# EasyEDA schematic Sheet_1.json
TITLE: Sheet_1; REV: 1.0; Date: 2025-05-09; Sheet: 1/1; Drawn By: ahmadputracahyo; Company: Your Company
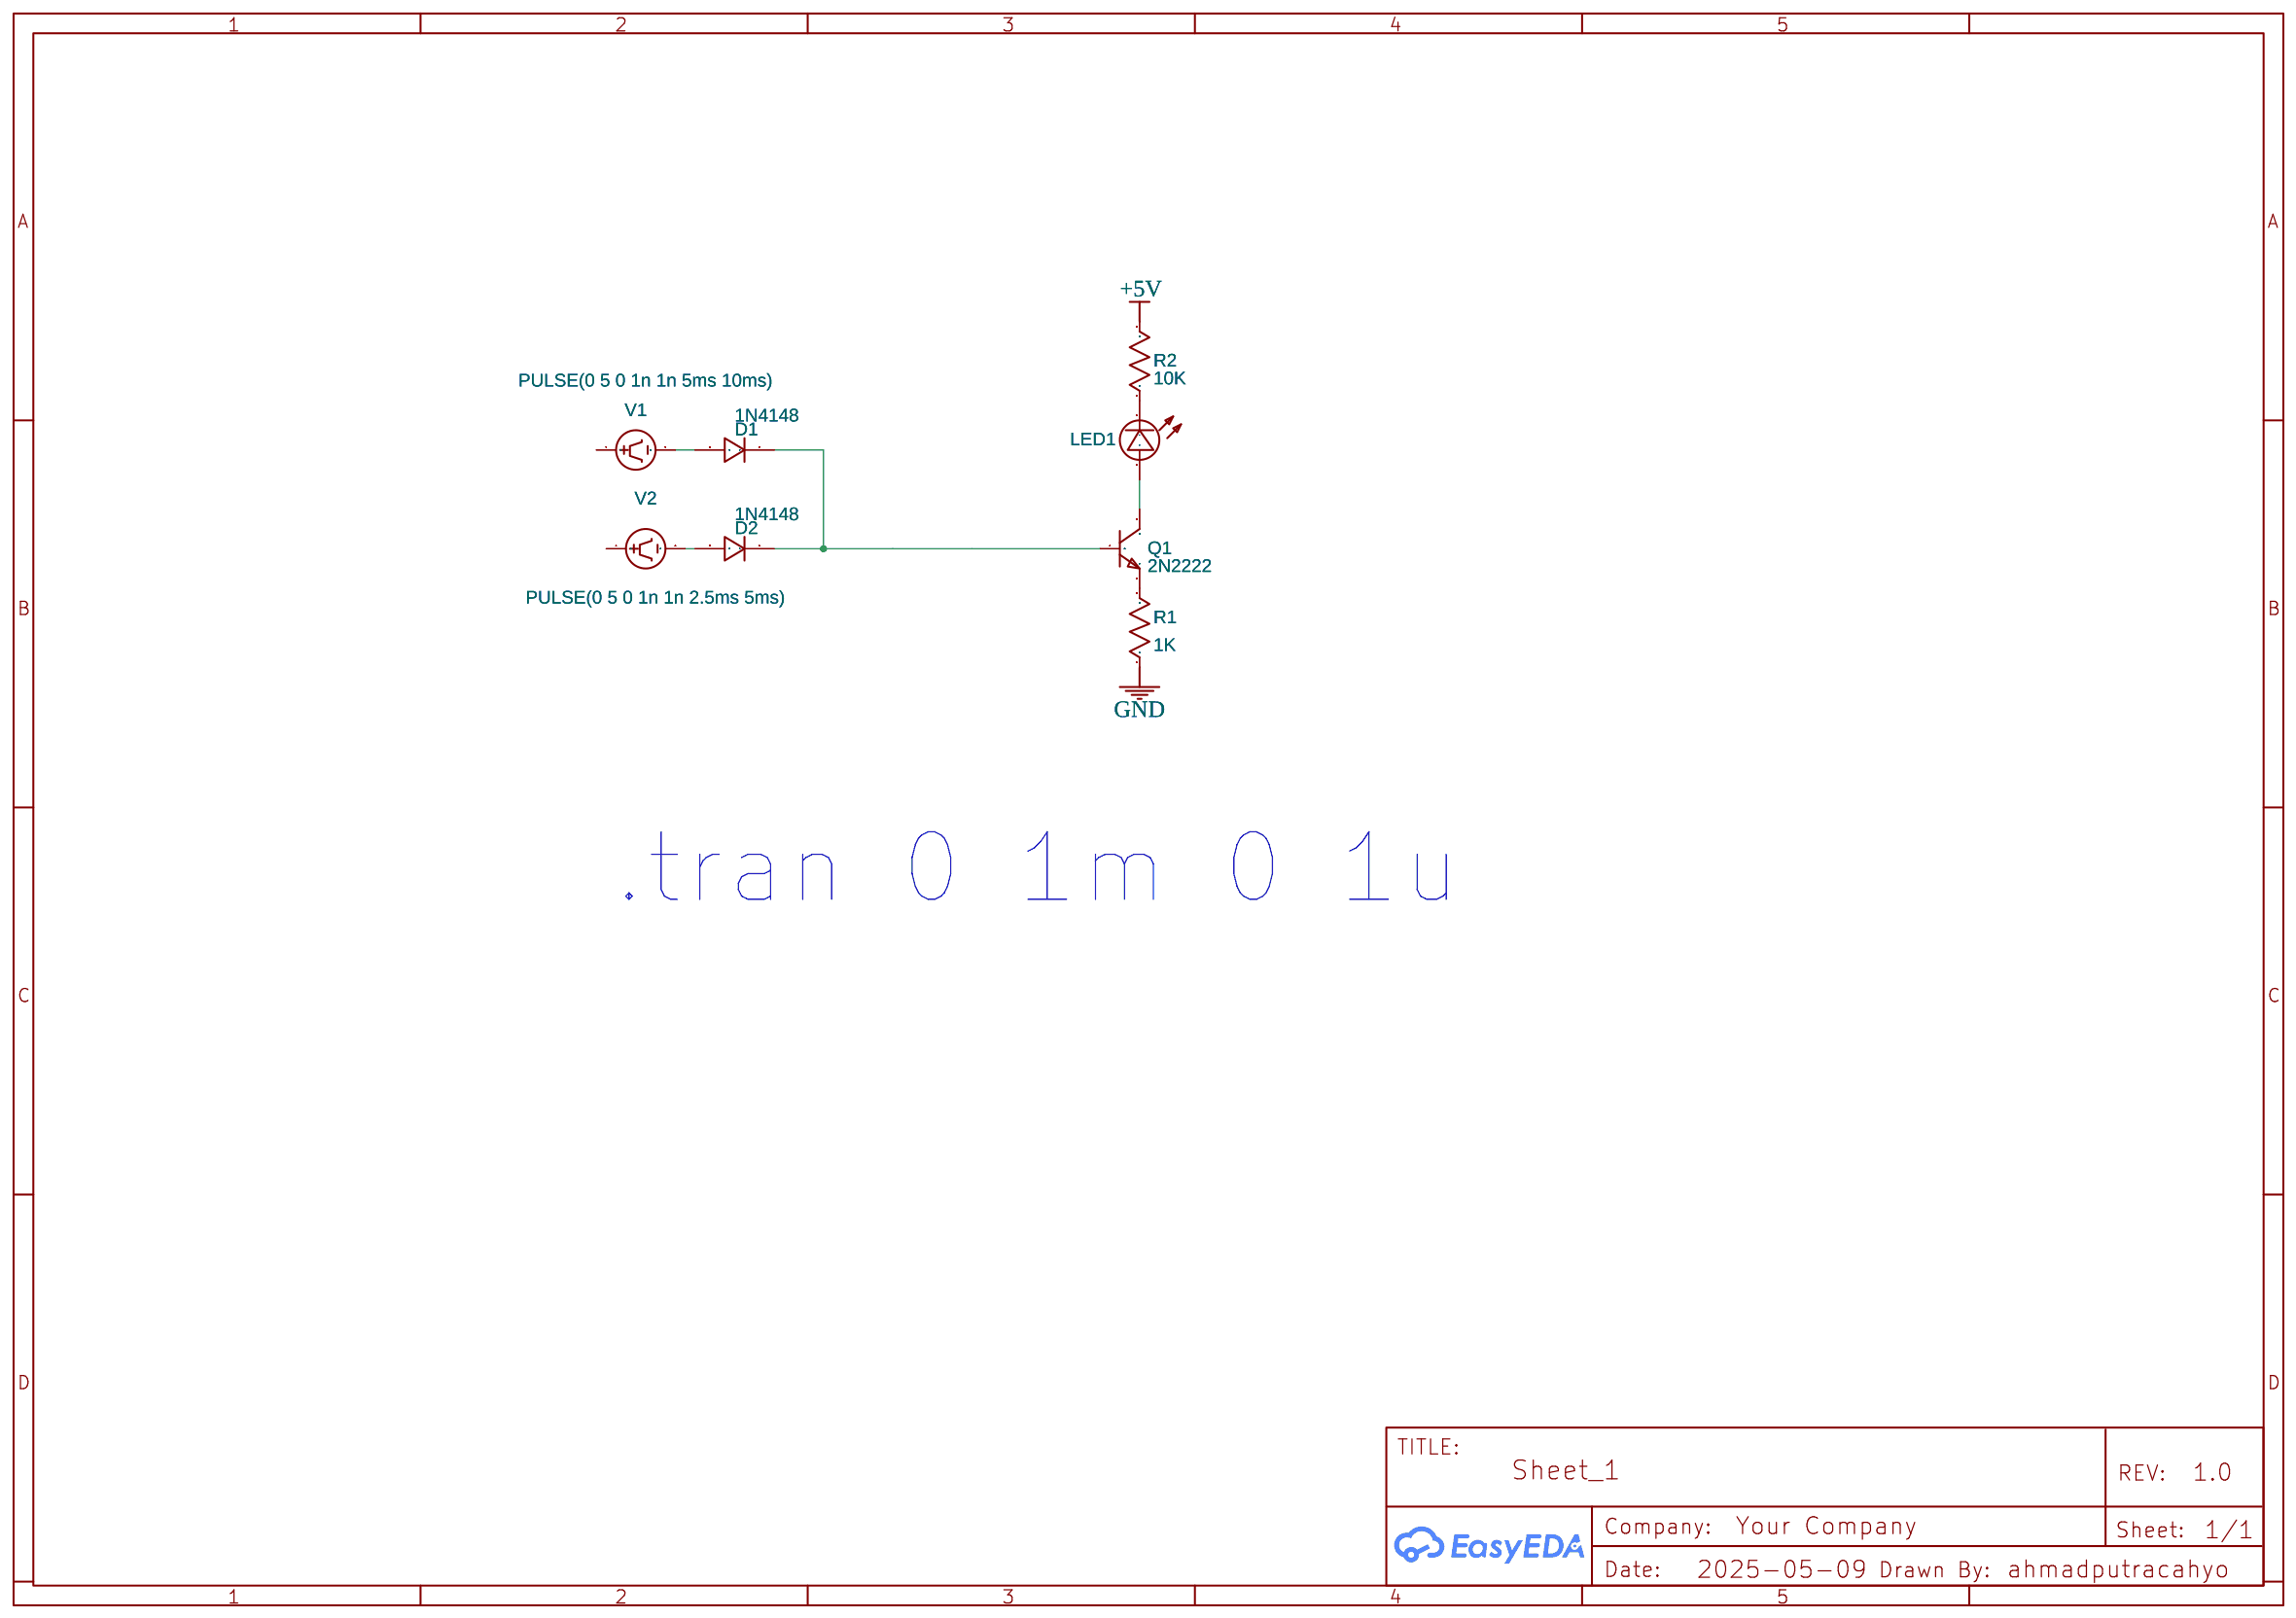
[diagram p0: schematic sheet]

## Parts
D1  1N4148  [DO-35_BD2.0-L4.2-P8.20-D0.5-RD]
D2  1N4148  [DO-35_BD2.0-L4.2-P8.20-D0.5-RD]
LED1  LED
Q1  2N2222
R1  1K  [AXIAL-0.3]
R2  10K  [AXIAL-0.3]
V1  PULSE(0 5 0 1n 1n 5ms 10ms)  [HDR1X2]
V2  PULSE(0 5 0 1n 1n 2.5ms 5ms)  [HDR1X2]

## Library data of the parts
D1 D2 = 1N4148: Supplier: LCSC; Supplier Part: C13769; Manufacturer: STMicroelectronics; Contributor: lytvynenko_ak20; sim: true
LED1 = LED: catid: 20; Contributor: 仿真库绘制; Color: Red; NameDisplay: 0
Q1 = 2N2222: Contributor: EasyEDA
R1 R2 = Resistor_US: Resistance: 1k; Contributor: EasyEDA; Supplier: YUJING
V1 V2 = VPULSE: Contributor: Murugeswaran

## Nets
+5V: R2.2
GND: R1.1
Net-(D1-1): D1.1 D2.1 Q1.1(B)
Net-(D1-2): D1.2 V1.2
Net-(D2-2): D2.2 V2.2
Net-(LED1-1): LED1.1(+) Q1.3(C)
Net-(LED1-2): LED1.2(-) R2.1
Net-(Q1-2): Q1.2(E) R1.2

Not connected (* = marked no-connect by the designer): V1 1; V2 1

## Notes on the sheet
- .tran 0 1m 0 1u
